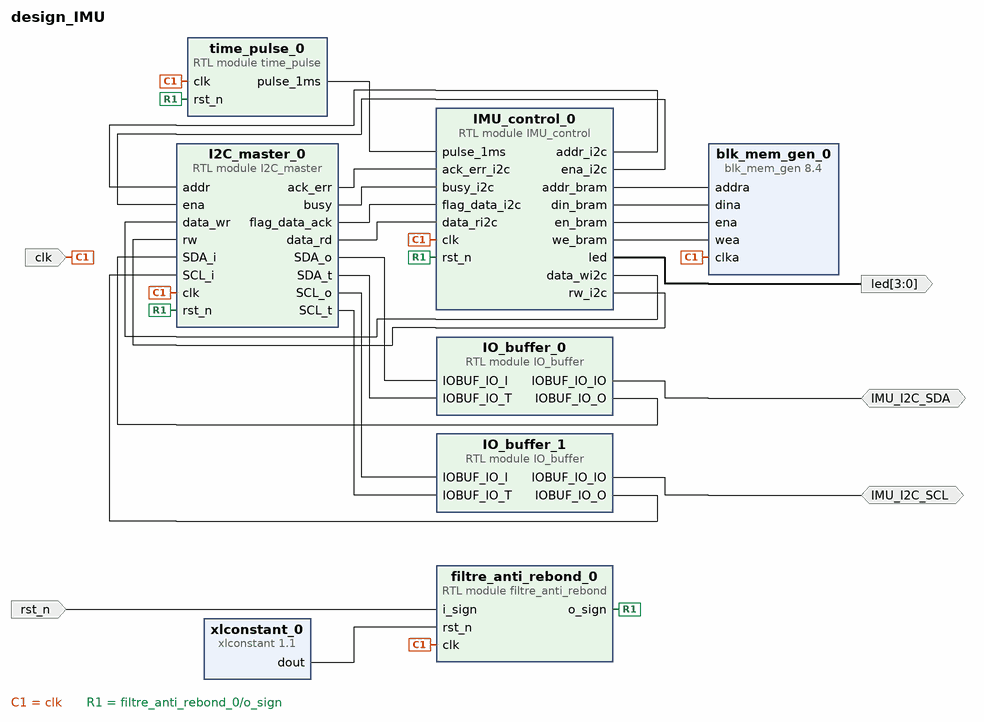
[diagram p0: block diagram of the top level]
# Vivado block design design_IMU, xc7z020clg400-1, Vivado 2020.2
create_bd_design design_IMU

create_bd_port -dir I -type clk clk
create_bd_port -dir I -type rst rst_n
create_bd_port -dir O -from 3 -to 0 led
create_bd_port -dir IO IMU_I2C_SDA
create_bd_port -dir IO IMU_I2C_SCL

create_bd_cell -type module -reference I2C_master I2C_master_0
create_bd_cell -type module -reference filtre_anti_rebond filtre_anti_rebond_0
create_bd_cell -type module -reference time_pulse time_pulse_0
create_bd_cell -type module -reference IO_buffer IO_buffer_0
create_bd_cell -type module -reference IO_buffer IO_buffer_1
create_bd_cell -type ip -vlnv xilinx.com:ip:blk_mem_gen:8.4 blk_mem_gen_0
set_property -dict [list \
  CONFIG.Algorithm Minimum_Area \
  CONFIG.Enable_32bit_Address false \
  CONFIG.Operating_Mode_A NO_CHANGE \
  CONFIG.Read_Width_A 16 \
  CONFIG.Register_PortA_Output_of_Memory_Primitives false \
  CONFIG.Use_Byte_Write_Enable false \
  CONFIG.Use_RSTA_Pin false \
  CONFIG.Write_Depth_A 256 \
  CONFIG.Write_Width_A 16 \
  CONFIG.use_bram_block Stand_Alone \
] [get_bd_cells blk_mem_gen_0]
create_bd_cell -type ip -vlnv xilinx.com:ip:xlconstant:1.1 xlconstant_0
create_bd_cell -type module -reference IMU_control IMU_control_0

# ---- connections ----

connect_bd_net -net clk_0_1 [get_bd_ports clk] \
  [get_bd_pins time_pulse_0/clk] [get_bd_pins filtre_anti_rebond_0/clk] [get_bd_pins I2C_master_0/clk] \
  [get_bd_pins blk_mem_gen_0/clka] [get_bd_pins IMU_control_0/clk]
connect_bd_net -net rst_n_0_1 [get_bd_pins filtre_anti_rebond_0/o_sign] \
  [get_bd_pins time_pulse_0/rst_n] [get_bd_pins I2C_master_0/rst_n] [get_bd_pins IMU_control_0/rst_n]
connect_bd_net [get_bd_pins I2C_master_0/ack_err] [get_bd_pins IMU_control_0/ack_err_i2c]
connect_bd_net [get_bd_pins IMU_control_0/addr_i2c] [get_bd_pins I2C_master_0/addr]
connect_bd_net [get_bd_pins IMU_control_0/ena_i2c] [get_bd_pins I2C_master_0/ena]
connect_bd_net [get_bd_pins IMU_control_0/led] [get_bd_ports led]
connect_bd_net -net rst_n_0_2 [get_bd_ports rst_n] [get_bd_pins filtre_anti_rebond_0/i_sign]
connect_bd_net [get_bd_pins I2C_master_0/SDA_o] [get_bd_pins IO_buffer_0/IOBUF_IO_I]
connect_bd_net [get_bd_pins I2C_master_0/SDA_t] [get_bd_pins IO_buffer_0/IOBUF_IO_T]
connect_bd_net [get_bd_ports IMU_I2C_SDA] [get_bd_pins IO_buffer_0/IOBUF_IO_IO]
connect_bd_net [get_bd_ports IMU_I2C_SCL] [get_bd_pins IO_buffer_1/IOBUF_IO_IO]
connect_bd_net [get_bd_pins I2C_master_0/SCL_o] [get_bd_pins IO_buffer_1/IOBUF_IO_I]
connect_bd_net [get_bd_pins I2C_master_0/SCL_t] [get_bd_pins IO_buffer_1/IOBUF_IO_T]
connect_bd_net [get_bd_pins IO_buffer_1/IOBUF_IO_O] [get_bd_pins I2C_master_0/SCL_i]
connect_bd_net [get_bd_pins IO_buffer_0/IOBUF_IO_O] [get_bd_pins I2C_master_0/SDA_i]
connect_bd_net [get_bd_pins IMU_control_0/data_wi2c] [get_bd_pins I2C_master_0/data_wr]
connect_bd_net [get_bd_pins IMU_control_0/rw_i2c] [get_bd_pins I2C_master_0/rw]
connect_bd_net [get_bd_pins I2C_master_0/busy] [get_bd_pins IMU_control_0/busy_i2c]
connect_bd_net [get_bd_pins I2C_master_0/flag_data_ack] [get_bd_pins IMU_control_0/flag_data_i2c]
connect_bd_net [get_bd_pins I2C_master_0/data_rd] [get_bd_pins IMU_control_0/data_ri2c]
connect_bd_net [get_bd_pins time_pulse_0/pulse_1ms] [get_bd_pins IMU_control_0/pulse_1ms]
connect_bd_net [get_bd_pins IMU_control_0/addr_bram] [get_bd_pins blk_mem_gen_0/addra]
connect_bd_net [get_bd_pins IMU_control_0/din_bram] [get_bd_pins blk_mem_gen_0/dina]
connect_bd_net [get_bd_pins IMU_control_0/en_bram] [get_bd_pins blk_mem_gen_0/ena]
connect_bd_net [get_bd_pins IMU_control_0/we_bram] [get_bd_pins blk_mem_gen_0/wea]
connect_bd_net [get_bd_pins xlconstant_0/dout] [get_bd_pins filtre_anti_rebond_0/rst_n]

validate_bd_design
save_bd_design
